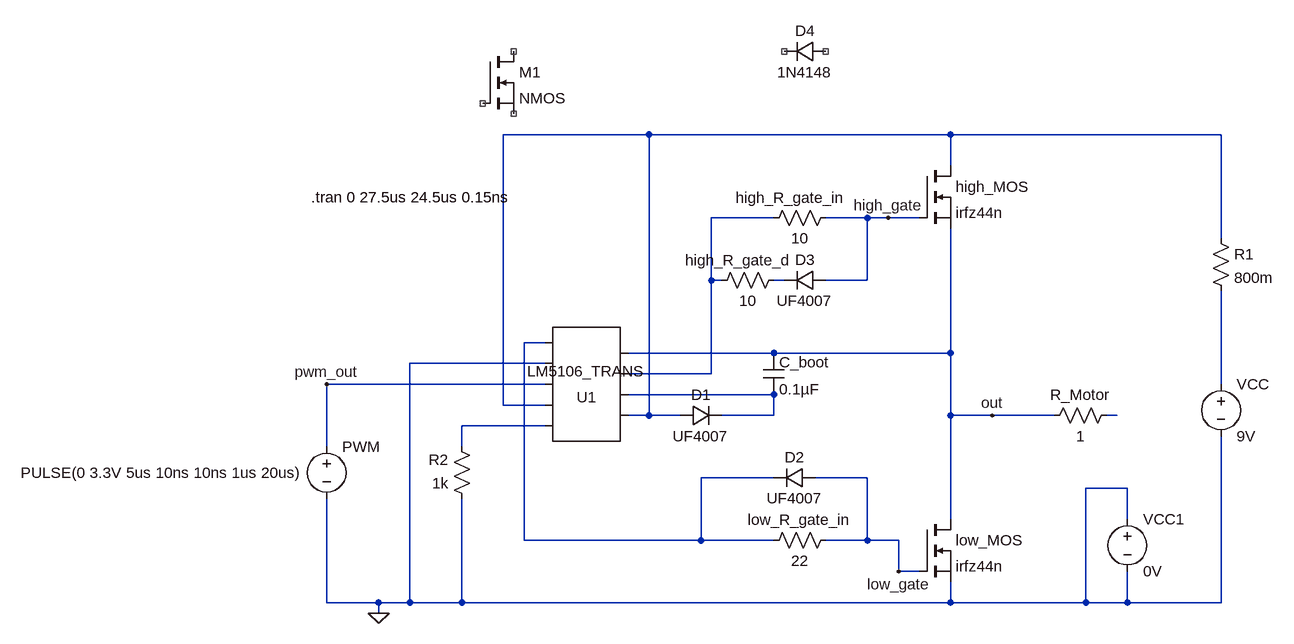
[diagram p0: schematic powerStage.asc]
powerStage.asc, the LTspice schematic file:
Version 4
SHEET 1 1432 680
WIRE 464 -368 240 -368
WIRE 928 -368 464 -368
WIRE 1344 -368 928 -368
WIRE 928 -320 928 -368
WIRE 656 -240 560 -240
WIRE 800 -240 736 -240
WIRE 832 -240 800 -240
WIRE 880 -240 832 -240
WIRE 1344 -208 1344 -368
WIRE 560 -144 560 -240
WIRE 576 -144 560 -144
WIRE 672 -144 656 -144
WIRE 800 -144 800 -240
WIRE 800 -144 736 -144
WIRE 304 -48 272 -48
WIRE 656 -32 432 -32
WIRE 928 -32 928 -224
WIRE 928 -32 656 -32
WIRE 304 -16 96 -16
WIRE 560 0 560 -144
WIRE 560 0 432 0
WIRE 304 16 -32 16
WIRE 1344 16 1344 -128
WIRE 656 32 432 32
WIRE 240 48 240 -368
WIRE 304 48 240 48
WIRE 464 64 464 -368
WIRE 464 64 432 64
WIRE 512 64 464 64
WIRE 656 64 656 32
WIRE 656 64 576 64
WIRE 928 64 928 -32
WIRE 992 64 928 64
WIRE 1088 64 992 64
WIRE 1184 64 1168 64
WIRE 304 80 176 80
WIRE -32 112 -32 16
WIRE 176 112 176 80
WIRE 656 160 544 160
WIRE 800 160 720 160
WIRE 1200 176 1136 176
WIRE 928 224 928 64
WIRE 1200 224 1200 176
WIRE 272 256 272 -48
WIRE 544 256 544 160
WIRE 544 256 272 256
WIRE 656 256 544 256
WIRE 800 256 800 160
WIRE 800 256 736 256
WIRE 848 256 800 256
WIRE 848 304 848 256
WIRE 880 304 848 304
WIRE -32 352 -32 192
WIRE 48 352 -32 352
WIRE 96 352 96 -16
WIRE 96 352 48 352
WIRE 176 352 176 192
WIRE 176 352 96 352
WIRE 928 352 928 320
WIRE 928 352 176 352
WIRE 1136 352 1136 176
WIRE 1136 352 928 352
WIRE 1200 352 1200 304
WIRE 1200 352 1136 352
WIRE 1344 352 1344 96
WIRE 1344 352 1200 352
WIRE 48 368 48 352
FLAG 48 368 0
FLAG -32 16 pwm_out
FLAG 848 304 low_gate
FLAG 832 -240 high_gate
FLAG 992 64 out
DATAFLAG 176 16 ""
SYMBOL voltage -32 96 R0
WINDOW 3 -37 56 Right 2
WINDOW 123 0 0 Left 0
WINDOW 39 0 0 Left 0
SYMATTR Value PULSE(0 3.3V 5us 10ns 10ns 1us 20us)
SYMATTR InstName PWM
SYMBOL voltage 1344 0 R0
WINDOW 123 0 0 Left 0
WINDOW 39 0 0 Left 0
SYMATTR InstName VCC
SYMATTR Value 9V
SYMBOL nmos 880 224 R0
SYMATTR InstName low_MOS
SYMATTR Value irfz44n
SYMBOL res 1184 48 R90
WINDOW 0 0 56 VBottom 2
WINDOW 3 32 56 VTop 2
SYMATTR InstName R_Motor
SYMATTR Value 1
SYMBOL res 752 240 R90
WINDOW 0 0 56 VBottom 2
WINDOW 3 32 56 VTop 2
SYMATTR InstName low_R_gate_in
SYMATTR Value 22
SYMBOL AutoGenerated\\LM5106_TRANS 368 16 R180
SYMATTR InstName U1
SYMBOL res 192 208 R180
WINDOW 0 36 76 Left 2
WINDOW 3 36 40 Left 2
SYMATTR InstName R2
SYMATTR Value 1k
SYMBOL nmos 880 -320 R0
SYMATTR InstName high_MOS
SYMATTR Value irfz44n
SYMBOL res 752 -256 R90
WINDOW 0 1 70 VBottom 2
WINDOW 3 32 56 VTop 2
SYMATTR InstName high_R_gate_in
SYMATTR Value 10
SYMBOL cap 640 -32 R0
WINDOW 0 24 14 Left 2
SYMATTR InstName C_boot
SYMATTR Value 0.1µF
SYMBOL diode 512 80 R270
WINDOW 0 32 32 VTop 2
WINDOW 3 0 32 VBottom 2
SYMATTR InstName D1
SYMATTR Value UF4007
SYMBOL voltage 1200 208 R0
WINDOW 123 0 0 Left 0
WINDOW 39 0 0 Left 0
SYMATTR InstName VCC1
SYMATTR Value 0V
SYMBOL diode 720 144 R90
WINDOW 0 0 32 VBottom 2
WINDOW 3 32 32 VTop 2
SYMATTR InstName D2
SYMATTR Value UF4007
SYMBOL diode 736 -160 R90
WINDOW 0 0 32 VBottom 2
WINDOW 3 32 32 VTop 2
SYMATTR InstName D3
SYMATTR Value UF4007
SYMBOL res 1328 -224 R0
SYMATTR InstName R1
SYMATTR Value 800m
SYMBOL diode 736 -512 R90
WINDOW 0 0 32 VBottom 2
WINDOW 3 32 32 VTop 2
SYMATTR InstName D4
SYMATTR Value 1N4148
SYMBOL nmos 208 -496 R0
SYMATTR InstName M1
SYMBOL res 672 -160 R90
WINDOW 0 1 70 VBottom 2
WINDOW 3 32 56 VTop 2
SYMATTR InstName high_R_gate_d
SYMATTR Value 10
TEXT -56 -272 Left 2 !.tran 0 27.5us 24.5us 0.15ns

The netlist it stands for:
* powerStage.asc
V§PWM pwm_out 0 PULSE(0 3.3V 5us 10ns 10ns 1us 20us)
VCC N005 0 9V
M§low_MOS out low_gate 0 0 irfz44n
R_Motor N007 out 1
R§low_R_gate_in low_gate N004 22
* U1: LM5106_TRANS (symbol AutoGenerated\LM5106_TRANS not available, pins judged from their places): pin1=N001 pin2=N006 pin3=N002 pin4=out pin5=N008 pin6=N001 pin7=pwm_out pin8=0 pin9=N004
R2 0 N008 1k
M§high_MOS N001 high_gate out out irfz44n
R§high_R_gate_in high_gate N002 10
C_boot out N006 0.1µF
D1 N001 N006 UF4007
VCC1 0 0 0V
D2 low_gate N004 UF4007
D3 high_gate N003 UF4007
R1 N001 N005 800m
D4 NC_01 NC_02 1N4148
M1 NC_03 NC_04 NC_05 NC_05 NMOS
R§high_R_gate_d N003 N002 10
.model D D
.lib standard.dio
.model NMOS NMOS
.model PMOS PMOS
.lib standard.mos
.tran 0 27.5us 24.5us 0.15ns
.backanno
.end